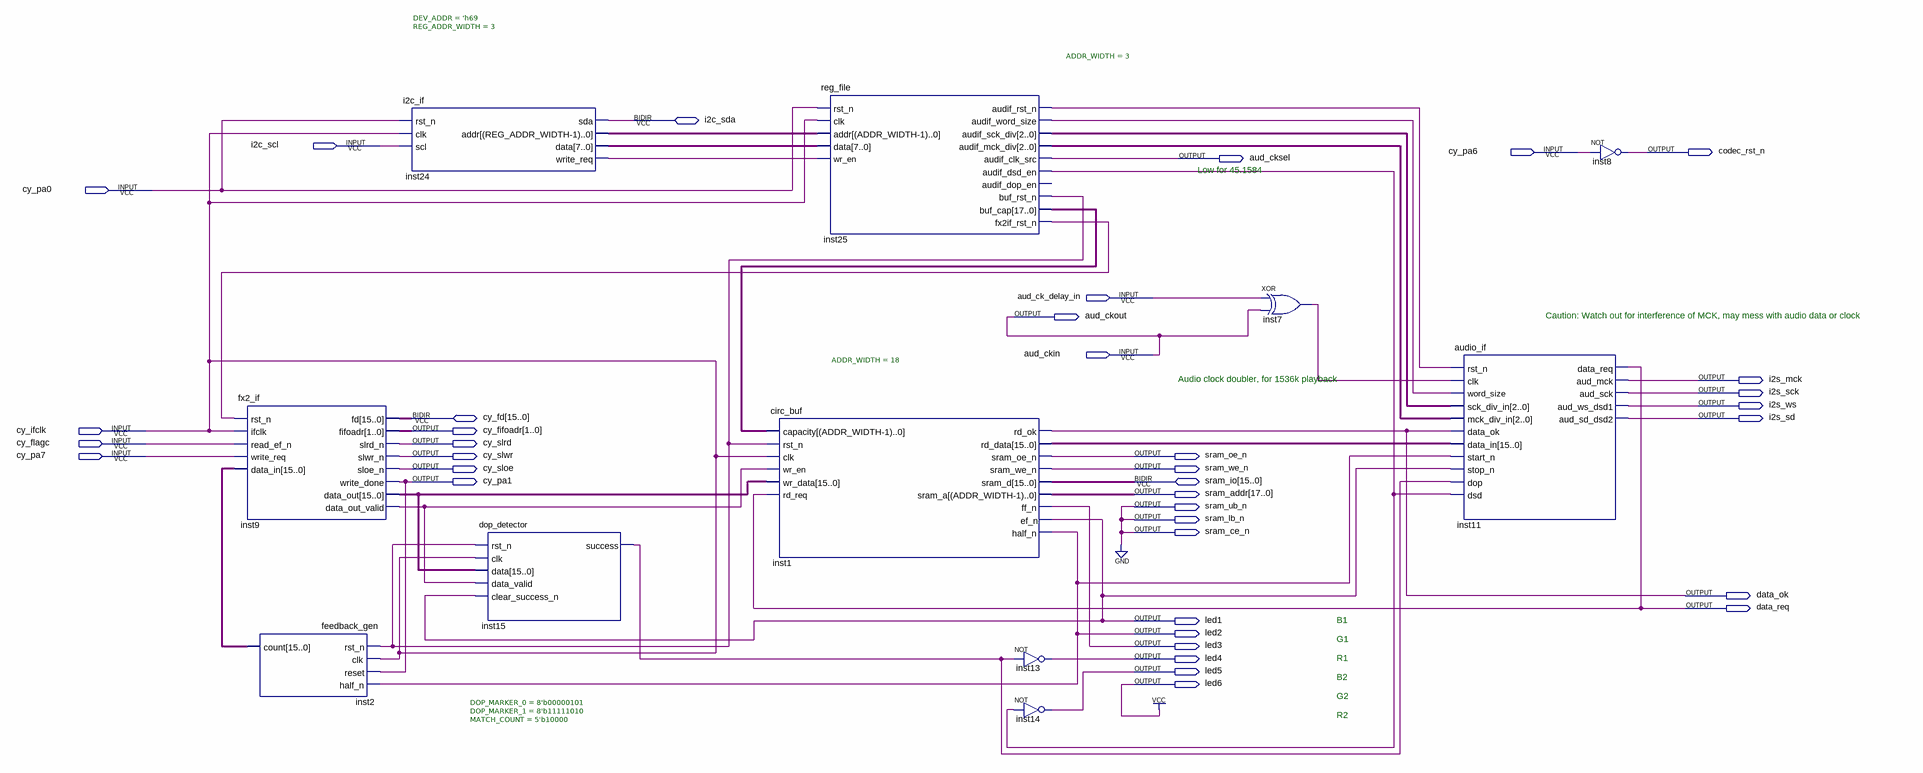
[diagram p0: schematic sheet]
// Quartus schematic top.bdf as structural Verilog: 11 symbols, 37 pins
module top (
  input  i2c_scl,
  input  cy_pa6,
  input  cy_pa0,
  input  aud_ck_delay_in,
  input  aud_ckin,
  input  cy_ifclk,
  input  cy_flagc,
  input  cy_pa7,
  inout  i2c_sda,
  inout  [15:0] cy_fd,
  inout  [15:0] sram_io,
  output codec_rst_n,
  output aud_cksel,
  output aud_ckout,
  output i2s_mck,
  output i2s_sck,
  output i2s_ws,
  output i2s_sd,
  output [1:0] cy_fifoadr,
  output cy_slrd,
  output cy_slwr,
  output sram_oe_n,
  output cy_sloe,
  output sram_we_n,
  output cy_pa1,
  output [17:0] sram_addr,
  output sram_ub_n,
  output sram_lb_n,
  output sram_ce_n,
  output data_ok,
  output data_req,
  output led1,
  output led2,
  output led3,
  output led4,
  output led5,
  output led6
);

  wire inst7_out, inst9_data_out_valid, inst15_success, inst24_write_req, inst25_audif_dsd_en,
       inst25_audif_rst_n, inst25_audif_word_size, inst25_buf_rst_n, inst25_fx2if_rst_n;
  wire [2:0] inst24_addr, inst25_audif_mck_div, inst25_audif_sck_div;
  wire [7:0] inst24_data;
  wire [15:0] inst1_rd_data, inst2_count, inst9_data_out;
  wire [17:0] inst25_buf_cap;

  fx2_if inst9 (
    .rst_n(inst25_fx2if_rst_n), .ifclk(cy_ifclk), .read_ef_n(cy_flagc), .write_req(cy_pa7),
    .data_in(inst2_count), .fifoadr(cy_fifoadr), .slrd_n(cy_slrd), .slwr_n(cy_slwr), .sloe_n(cy_sloe),
    .write_done(cy_pa1), .data_out(inst9_data_out), .data_out_valid(inst9_data_out_valid), .fd(cy_fd));
  feedback_gen inst2 (.rst_n(inst25_buf_rst_n), .clk(cy_ifclk), .reset(cy_pa1), .half_n(led2), .count(inst2_count));
  i2c_if #(.DEV_ADDR('h69), .REG_ADDR_WIDTH(3)) inst24 (
    .rst_n(cy_pa0), .clk(cy_ifclk), .scl(i2c_scl), .addr(inst24_addr), .data(inst24_data),
    .write_req(inst24_write_req), .sda(i2c_sda));
  dop_detector #(.DOP_MARKER_0(8'b00000101), .DOP_MARKER_1(8'b11111010), .MATCH_COUNT(5'b10000)) inst15 (
    .rst_n(inst25_buf_rst_n), .clk(cy_ifclk), .data(inst9_data_out), .data_valid(inst9_data_out_valid),
    .clear_success_n(led1), .success(inst15_success));
  circ_buf #(.ADDR_WIDTH(18)) inst1 (
    .capacity(inst25_buf_cap), .rst_n(inst25_buf_rst_n), .clk(cy_ifclk), .wr_en(inst9_data_out_valid),
    .wr_data(inst9_data_out), .rd_req(data_req), .rd_ok(data_ok), .rd_data(inst1_rd_data),
    .sram_oe_n(sram_oe_n), .sram_we_n(sram_we_n), .sram_a(sram_addr), .ff_n(led3), .ef_n(led1),
    .half_n(led2), .sram_d(sram_io));
  reg_file #(.ADDR_WIDTH(3)) inst25 (
    .rst_n(cy_pa0), .clk(cy_ifclk), .addr(inst24_addr), .data(inst24_data), .wr_en(inst24_write_req),
    .audif_rst_n(inst25_audif_rst_n), .audif_word_size(inst25_audif_word_size),
    .audif_sck_div(inst25_audif_sck_div), .audif_mck_div(inst25_audif_mck_div), .audif_clk_src(aud_cksel),
    .audif_dsd_en(inst25_audif_dsd_en), .buf_rst_n(inst25_buf_rst_n), .buf_cap(inst25_buf_cap),
    .fx2if_rst_n(inst25_fx2if_rst_n));  // open: audif_dop_en
  not inst13 (led4, inst15_success);
  not inst14 (led5, inst25_audif_dsd_en);
  xor inst7 (inst7_out, aud_ck_delay_in, aud_ckin);
  audio_if inst11 (
    .rst_n(inst25_audif_rst_n), .clk(inst7_out), .word_size(inst25_audif_word_size),
    .sck_div_in(inst25_audif_sck_div), .mck_div_in(inst25_audif_mck_div), .data_ok(data_ok),
    .data_in(inst1_rd_data), .start_n(led2), .stop_n(led1), .dop(inst15_success), .dsd(inst25_audif_dsd_en),
    .data_req(data_req), .aud_mck(i2s_mck), .aud_sck(i2s_sck), .aud_ws_dsd1(i2s_ws), .aud_sd_dsd2(i2s_sd));
  not inst8 (codec_rst_n, cy_pa6);

  assign aud_ckout = aud_ckin;
  assign led6 = 1'b1;
  assign sram_ce_n = 1'b0;
  assign sram_lb_n = 1'b0;
  assign sram_ub_n = 1'b0;

  // Notes on the sheet:
  //   Low for 45.1584
  //   Caution: Watch out for interference of MCK, may mess with audio data or clock
  //   Audio clock doubler, for 1536k playback
  //   B1
  //   G1
  //   R1
  //   B2
  //   G2
  //   R2
endmodule
